# Altium schematic sheet Hardware block diagram.SchDoc
size A4
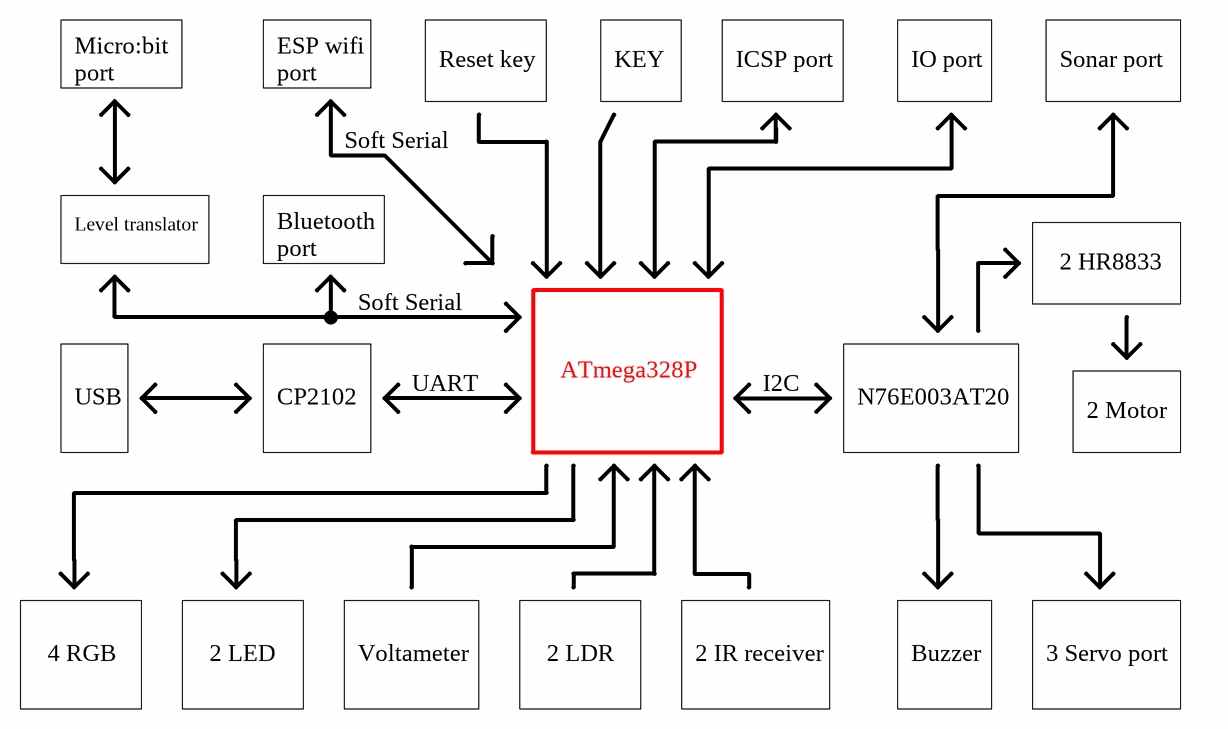
[diagram p0: Hardware block diagram.SchDoc]

## Notes on the sheet
- Micro:bit
- ESP wifi
- port
- Reset key
- KEY
- ICSP port
- IO port
- Sonar port
- Soft Serial
- Level translator
- Bluetooth
- 2 HR8833
- UART
- ATmega328P
- I2C
- USB
- CP2102
- N76E003AT20
- 2 Motor
- 4 RGB
- 2 LED
- Voltameter
- 2 LDR
- 2 IR receiver
- Buzzer
- 3 Servo port